# EAGLE schematic piggyback (EAGLE 6.4)
Teensy3 Piggyback Includes MicroSD and Lipo charger Note: you should separate the contacts on the Teensy that join Vin to Vusb and then this charger circuit will supply power to Vin instead.
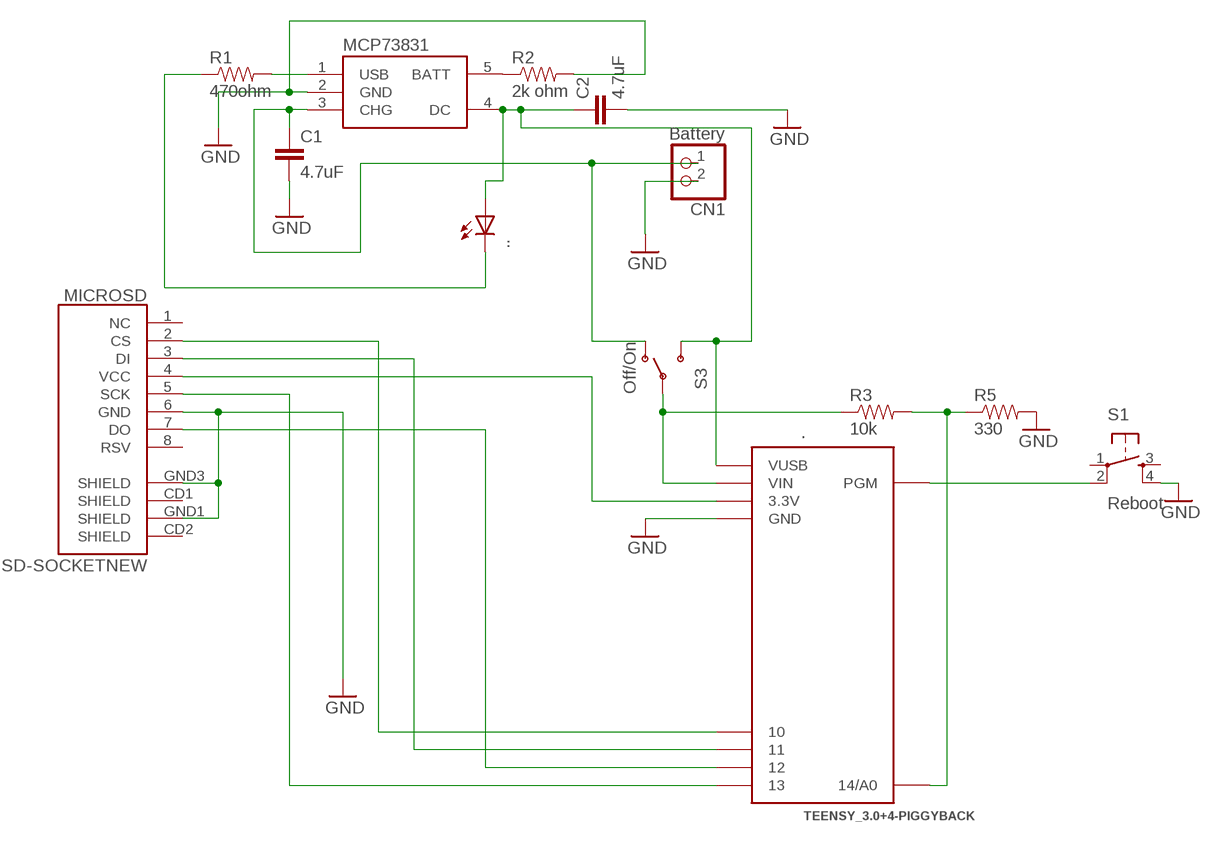
[diagram p0: schematic, sheet 1]

## Parts
.  TEENSY_3.0+4-PIGGYBACK  [TEENSY_3.0+4-PIGGYBACK]
..  LEDCHIP-LED0805  [CHIP-LED0805]
C1  4.7uF  CAP0805  [0805]
C2  4.7uF  CAP0805  [0805]
CN1  Battery  JST_2PIN-THM  [JST-PH-2-THM]
MCP73831  MAX1555  [SOT23-5]
MICROSD  USD-SOCKETNEW  [MICRO-SD-SOCKET-PP]
R1  470ohm  RESISTOR  [0805]
R2  2k ohm  RESISTOR  [0805]
R3  10k  RESISTOR0805-RES  [0805]
R5  330  RESISTOR0805-RES  [0805]
S1  Reboot  TAC_SWITCHSMD  [TACTILE_SWITCH_SMD]
S3  Off/On  SWITCH-SPDT-SMD-A  [SWITCH-SPST-SMD-A]

## Nets
DI: ..11 MICROSD.3(DI)
DO: ..12 MICROSD.7(DO)
GND: ..GND1(GND) C1.2 C2.2 CN1.2 MCP73831.2(GND) MICROSD.6(GND) MICROSD.GND1(SHIELD) MICROSD.GND3(SHIELD) R2.2 R5.2 S1.4
N$1: MCP73831.5(BATT) R2.1
N$3: C1.1 CN1.1 MCP73831.3(CHG) S3.1(O)
N$4: ...C R1.1
N$5: MCP73831.1(USB) R1.2
N$6: ...A ..VUSB C2.1 MCP73831.4(DC) S3.3(S)
N$7: ..PGM S1.2
N$8: ..VIN R3.1 S3.2(P)
N$9: ..3.3V1(3.3V) MICROSD.4(VCC)
N$10: ..14/A0 R3.2 R5.1
N$12: ..13 MICROSD.5(SCK)
N$14: ..10 MICROSD.2(CS)
Unconnected: MICROSD.1(NC) MICROSD.8(RSV) MICROSD.CD1(SHIELD) MICROSD.CD2(SHIELD) S1.1 S1.3

## Library data of the parts
. = Teensy3.0:TEENSY_3.0+4-PIGGYBACK: Teensy 3.0 piggy back board. Supports pin-throughs for microSD, Program button and power
.. = adafruit:LED: LED OSRAM: - CHIPLED LG R971, LG N971, LY N971, LG Q971, LY Q971, LO R971, LY R971 LH N974, LH R974 LS Q976, LO Q976, LY Q976 LO Q996 - Hyper CHIPLED LW Q18S LB Q993, LB Q99A, LB R99A - SideLED LS A670, LO A670, LY A670, LG A670, LP A670 LB A673, LV A673, LT A673, LW A673 LH A674 LY A675 LS A676, LA A676, LO A676, LY A676, LW A676 LS A679, LY A679, LG A679 - Hyper Micro SIDELED® LS Y876, LA Y876, LO Y876, LY Y876 LT Y87S - SmartLED LW L88C, LW L88S LB L89C, LB L89S, LG L890 LS L89K, LO L89K, LY L89K LS L896, LA L896, LO L896, LY L896 - TOPLED LS T670, LO T670, LY T670, LG T670, LP T670 LSG T670, LSP T670, LSY T670, LOP T670, LYG T670 LG T671, LOG T671, LSG T671 LB T673, LV T673, LT T673, LW T673 LH T674 LS T676, LA T676, LO T676, LY T676, LB T676, LH T676, LSB T676, LW T676 LB T67C, LV T67C, LT T67C, LS T67K, LO T67K, LY T67K, LW E67C LS E67B, LA E67B, LO E67B, LY E67B, LB E67C, LV E67C, LT E67C LW T67C LS T679, LY T679, LG T679 LS T770, LO T770, LY T770, LG T770, LP T770 LB T773, LV T773, LT T773, LW T773 LH T774 LS E675, LA E675, LY E675, LS T675 LS T776, LA T776, LO T776, LY T776, LB T776 LHGB T686 LT T68C, LB T68C - Hyper Mini TOPLED® LB M676 - Mini TOPLED Santana® LG M470 LS M47K, LO M47K, LY M47K Source: http://www.osram.convergy.de/
C1 C2 = SparkFun:CAP: Capacitor Standard 0603 ceramic capacitor, and 0.1" leaded capacitor.
CN1 = adafruit:JST_2PIN: JST 2-Pin Connectors of various flavors SMT-RA (S2B-PH-SM4) 4UConnector #17311 SMT (B2B-PH-SM4) THM-RA (S2B-PH) THM (B2B-PH)
MCP73831 = SparkFun:MAX1555: MAX1555 Lithium Charger IC SOT-23 Lithium Polymer charging IC. Schematic element and footprint proven. Spark Fun Electronics SKU : COM-00674
MICROSD = SparkFun-Connectors:USD-SOCKET: microSD Socket Push-push type uSD socket. Schematic element and footprint production proven. Spark Fun Electronics SKU : PRT-00127. tDoc lines correctly indicate media card edge positions when inserting (unlocked, locked, depressed).
R1 R2 = SparkFun:RESISTOR: Resistor
R3 R5 = SparkFun-Resistors:RESISTOR: Resistor
S1 = SparkFun-Electromechanical:TAC_SWITCH: Momentary Switch Button commonly used for reset or general input. Spark Fun Electronics SKU : COM-00097 SMT- SWCH-08247; PROD_ID: SWCH-08247
S3 = SparkFun-Electromechanical:SWITCH-SPDT: SPDT Switch Simple slide switch, Spark Fun Electronics SKU : COM-00102 DPDT SMT slide switch, AYZ0202, SWCH-08179